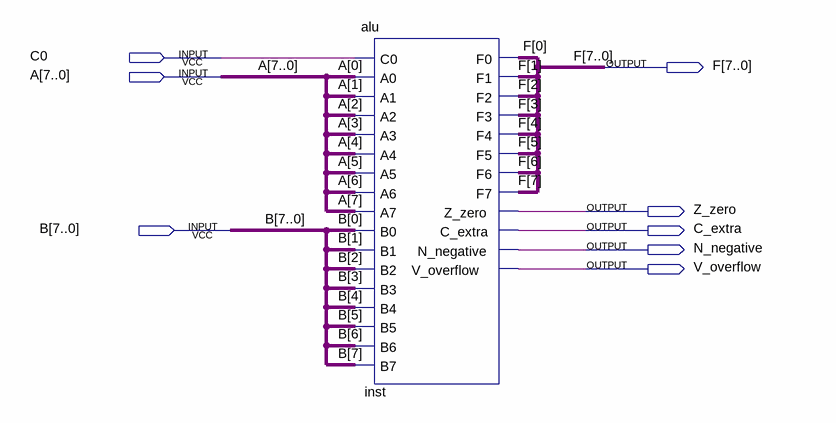
[diagram p0: schematic sheet]
// Quartus schematic alu_bus.bdf as structural Verilog: 1 symbols, 8 pins
module alu_bus (
  input  C0,
  input  [7:0] A,
  input  [7:0] B,
  output [7:0] F,
  output Z_zero,
  output C_extra,
  output N_negative,
  output V_overflow
);

  alu inst (
    .C0(C0), .A0(A[0]), .A1(A[1]), .A2(A[2]), .A3(A[3]), .A4(A[4]), .A5(A[5]), .A6(A[6]), .A7(A[7]),
    .B0(B[0]), .B1(B[1]), .B2(B[2]), .B3(B[3]), .B4(B[4]), .B5(B[5]), .B6(B[6]), .B7(B[7]), .F0(F[0]),
    .F1(F[1]), .F2(F[2]), .F3(F[3]), .F4(F[4]), .F5(F[5]), .F6(F[6]), .F7(F[7]), .Z_zero(Z_zero),
    .C_extra(C_extra), .N_negative(N_negative), .V_overflow(V_overflow));
endmodule
